# Altium schematic sheet VC_NRF5340.SchDoc: Overview
size A4; SheetNumber: 1; SheetTotal: 6; FileInfo: VC_NRF5340.SchDoc
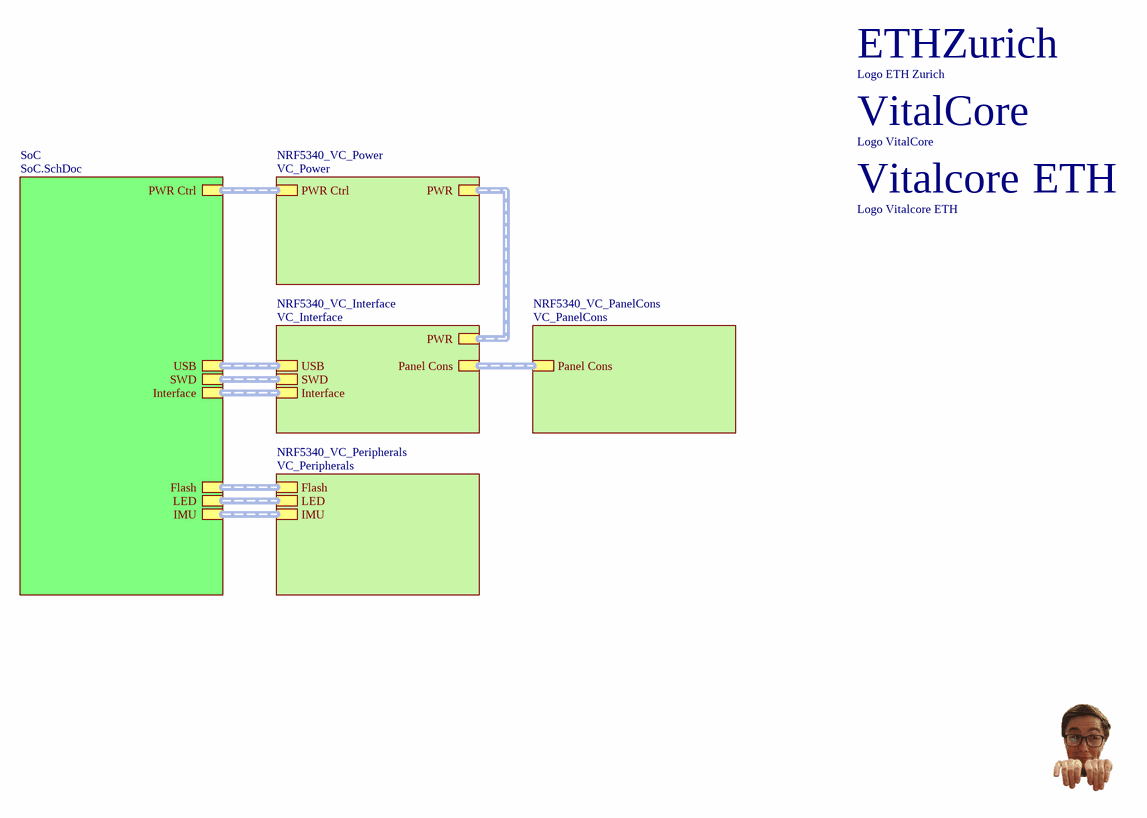
[diagram p0: VC_NRF5340.SchDoc]

## Parts
A1  Logo ETH Zurich  [LOGO_ETHZ_2MM]  (no BOM)
A2  Logo VitalCore  [LOGO_VITALCORE_2MM]  (no BOM)
A3  Logo Vitalcore ETH  [LOGO_VITALCORE_ETHZ_1.3MM_MASK]  (no BOM)

## Sub-sheets
NRF5340_VC_Interface = VC_Interface: USB (harness USB), PWR (harness PWR), SWD (harness SWD), Interface (harness Interface), Panel Cons (harness Panel Cons)
NRF5340_VC_PanelCons = VC_PanelCons: Panel Cons (harness Panel Cons)
NRF5340_VC_Peripherals = VC_Peripherals: Flash (harness Flash), IMU (harness IMU), LED (harness LED)
NRF5340_VC_Power = VC_Power: PWR (harness PWR), PWR Ctrl (harness PWR Ctrl)
SoC = SoC.SchDoc: USB (harness USB), SWD (harness SWD), Flash (harness Flash), LED (harness LED), PWR Ctrl (harness PWR Ctrl), Interface (harness Interface), IMU (harness IMU)

## Buses and harness runs
harness sheet NRF5340_VC_Interface/Interface = sheet SoC/Interface
harness sheet NRF5340_VC_Interface/Panel Cons = sheet NRF5340_VC_PanelCons/Panel Cons
harness sheet NRF5340_VC_Interface/PWR = sheet NRF5340_VC_Power/PWR
harness sheet NRF5340_VC_Interface/SWD = sheet SoC/SWD
harness sheet NRF5340_VC_Interface/USB = sheet SoC/USB
harness sheet NRF5340_VC_Peripherals/Flash = sheet SoC/Flash
harness sheet NRF5340_VC_Peripherals/IMU = sheet SoC/IMU
harness sheet NRF5340_VC_Peripherals/LED = sheet SoC/LED
harness sheet NRF5340_VC_Power/PWR Ctrl = sheet SoC/PWR Ctrl

## Notes on the sheet
- Project:
- Laboratory:
- Date:
- File:
- Rev:
- Variant:
- License:
- Drawn By:
- Checked By:
- Sheet:
- /
- (in symbol LOGO_ETHZ) ETHZurich
- (in symbol LOGO_VITALCORE) VitalCore
- (in symbol LOGO_VITALCORE_ETH) Vitalcore; ETH

## Library data of the parts
A1 = LOGO_ETHZ
A2 = LOGO_VITALCORE
A3 = LOGO_VITALCORE_ETH